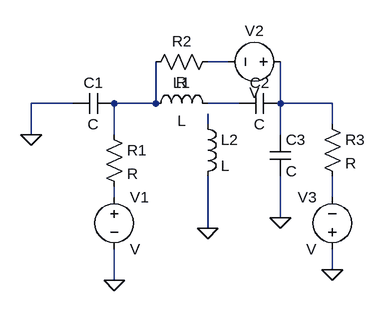
[diagram p0: schematic Draft1.asc]
Draft1.asc, the LTspice schematic file:
Version 4
SHEET 1 880 680
WIRE 272 -256 240 -256
WIRE 32 -192 -32 -192
WIRE 160 -192 160 -256
WIRE 160 -192 96 -192
WIRE 288 -192 240 -192
WIRE 352 -192 352 -256
WIRE 432 -192 352 -192
WIRE 240 -160 240 -176
WIRE 432 -160 432 -192
WIRE -32 -144 -32 -192
WIRE 96 -144 96 -192
WIRE 352 -144 352 -192
WIRE 96 -48 96 -64
WIRE 432 -48 432 -80
WIRE 352 -16 352 -80
WIRE 240 0 240 -80
WIRE 432 64 432 32
WIRE 96 80 96 32
FLAG -32 -144 0
FLAG 96 80 0
FLAG 240 0 0
FLAG 352 -16 0
FLAG 432 64 0
SYMBOL cap 96 -208 R90
WINDOW 0 0 32 VBottom 2
WINDOW 3 32 32 VTop 2
SYMATTR InstName C1
SYMBOL res 80 -160 R0
SYMATTR InstName R1
SYMBOL res 256 -272 R90
WINDOW 0 0 56 VBottom 2
WINDOW 3 32 56 VTop 2
SYMATTR InstName R2
SYMBOL ind 144 -176 R270
WINDOW 0 32 56 VTop 2
WINDOW 3 5 56 VBottom 2
SYMATTR InstName L1
SYMBOL ind 224 -176 R0
SYMATTR InstName L2
SYMBOL cap 352 -208 R90
WINDOW 0 0 32 VBottom 2
WINDOW 3 32 32 VTop 2
SYMATTR InstName C2
SYMBOL cap 336 -144 R0
SYMATTR InstName C3
SYMBOL res 416 -176 R0
SYMATTR InstName R3
SYMBOL voltage 96 -64 R0
SYMATTR InstName V1
SYMBOL voltage 368 -256 R90
WINDOW 0 -32 56 VBottom 2
WINDOW 3 32 56 VTop 2
SYMATTR InstName V2
SYMBOL voltage 432 48 R180
WINDOW 0 24 96 Left 2
WINDOW 3 24 16 Left 2
SYMATTR InstName V3

The netlist it stands for:
* Draft1.asc
C1 N002 0 C
R1 N002 N006 R
R2 N001 N002 R
L1 N002 N003 L
L2 N005 0 L
C2 N004 N003 C
C3 N004 0 C
R3 N004 N007 R
V1 N006 0 V
V2 N004 N001 V
V3 0 N007 V
.backanno
.end